# EAGLE design YOTSUBA_AP_EM_ver.1.0 (EAGLE 9.6.2)
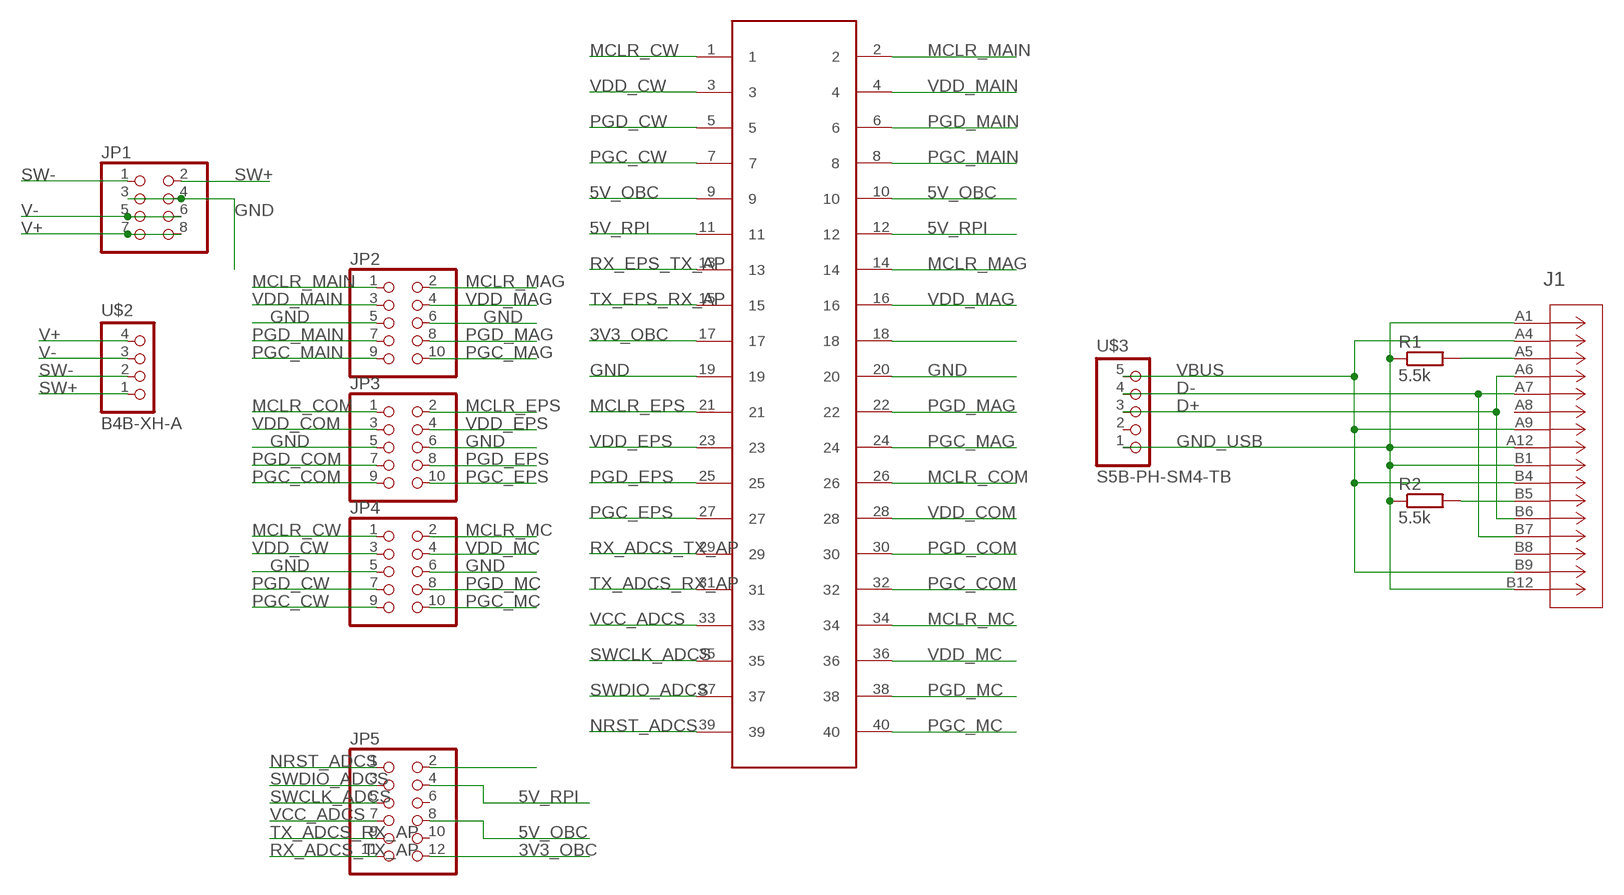
[diagram p0: schematic, sheet 1]

## Parts
J1  217182-0001  [CONN_217182-0001_MOL]
JP1  PINHD-2X4  [2X04]
JP2  PINHD-2X5  [2X05]
JP3  PINHD-2X5  [2X05]
JP4  PINHD-2X5  [2X05]
JP5  PINHD-2X6  [2X06]
R1  5.5k  R-EU_M2012  [M2012]
R2  5.5k  R-EU_M2012  [M2012]
U$1  M50-3902042  [M50-3902042]
U$2  B4B-XH-A  [B4B-XH-A]
U$3  S5B-PH-SM4-TB  [S5B-PH-SM4-TB]

## Nets
3V3_OBC: JP5.12 U$1.17
5V_OBC: JP5.8 U$1.9 U$1.10
5V_RPI: JP5.4 U$1.11 U$1.12
D+: J1.A6(DP1) J1.B6(DP2) U$3.3
D-: J1.A7(DN1) J1.B7(DN2) U$3.4
GND [gnd]: JP1.3 JP1.4 JP2.5 JP2.6 JP3.5 JP3.6 JP4.5 JP4.6 U$1.19 U$1.20
GND_USB [gnd_usb]: J1.A1(GND_2) J1.A12(GND_3) J1.B1(GND_4) J1.B12(GND) R1.1 R2.1 U$3.1
MCLR_COM: JP3.1 U$1.26
MCLR_CW: JP4.1 U$1.1
MCLR_EPS: JP3.2 U$1.21
MCLR_MAG: JP2.2 U$1.14
MCLR_MAIN: JP2.1 U$1.2
MCLR_MC: JP4.2 U$1.34
N$1: JP5.2
N$2: J1.A5(CC1) R1.2
N$3: J1.B5(CC2) R2.2
N$12: U$1.18
NRST_ADCS: JP5.1 U$1.39
PGC_COM: JP3.9 U$1.32
PGC_CW: JP4.9 U$1.7
PGC_EPS: JP3.10 U$1.27
PGC_MAG: JP2.10 U$1.24
PGC_MAIN: JP2.9 U$1.8
PGC_MC: JP4.10 U$1.40
PGD_COM: JP3.7 U$1.30
PGD_CW: JP4.7 U$1.5
PGD_EPS: JP3.8 U$1.25
PGD_MAG: JP2.8 U$1.22
PGD_MAIN: JP2.7 U$1.6
PGD_MC: JP4.8 U$1.38
RX_ADCS_TX_AP: JP5.11 U$1.29
RX_EPS_TX_AP: U$1.13
SW+ [pwr]: JP1.2 U$2.1
SW- [pwr]: JP1.1 U$2.2
SWCLK_ADCS: JP5.5 U$1.35
SWDIO_ADCS: JP5.3 U$1.37
TX_ADCS_RX_AP: JP5.9 U$1.31
TX_EPS_RX_AP: U$1.15
V+ [pwr]: JP1.7 JP1.8 U$2.4
V- [pwr]: JP1.5 JP1.6 U$2.3
VBUS: J1.A4(VBUS_2) J1.A9(VBUS_3) J1.B4(VBUS_4) J1.B9(VBUS) U$3.5
VCC_ADCS: JP5.7 U$1.33
VDD_COM: JP3.3 U$1.28
VDD_CW: JP4.3 U$1.3
VDD_EPS: JP3.4 U$1.23
VDD_MAG: JP2.4 U$1.16
VDD_MAIN: JP2.3 U$1.4
VDD_MC: JP4.4 U$1.36
Unconnected: J1.A8(SBU1) J1.B8(SBU2) JP5.6 JP5.10 U$3.2

## Library data of the parts
J1 = 2171820001:217182-0001; COPYRIGHT: Copyright (C) 2022 Ultra Librarian. All rights reserved.; DIGI-KEY_PART_NUMBER_1: 900-2171820001TR-ND; DIGI-KEY_PART_NUMBER_2: 900-2171820001CT-ND; DIGI-KEY_PART_NUMBER_3: 900-2171820001DKR-ND; MANUFACTURER_PART_NUMBER: 217182-0001; MFR_NAME: Molex Connector Corporation
JP1 = pinhead:PINHD-2X4: PIN HEADER
JP2-JP4 = pinhead:PINHD-2X5: PIN HEADER
JP5 = pinhead:PINHD-2X6: PIN HEADER
R1 R2 = rcl:R-EU_: RESISTOR, European symbol; SPICEPREFIX: R
U$1 = MITSUBA_Connectors-v4.0:M50-3902042: 40pins 1.27mm pitch 2line pinheader
U$2 = MITSUBA_Connectors-v4.0:B4B-XH-A
U$3 = MITSUBA_Connectors-v4.0:S5B-PH-SM4-TB

## Net classes
0 default: clearance 0.254 mm
1 gnd: clearance 0.559 mm
2 pwr: clearance 0.254 mm
3 gnd_usb: clearance 0.025 mm

## Board
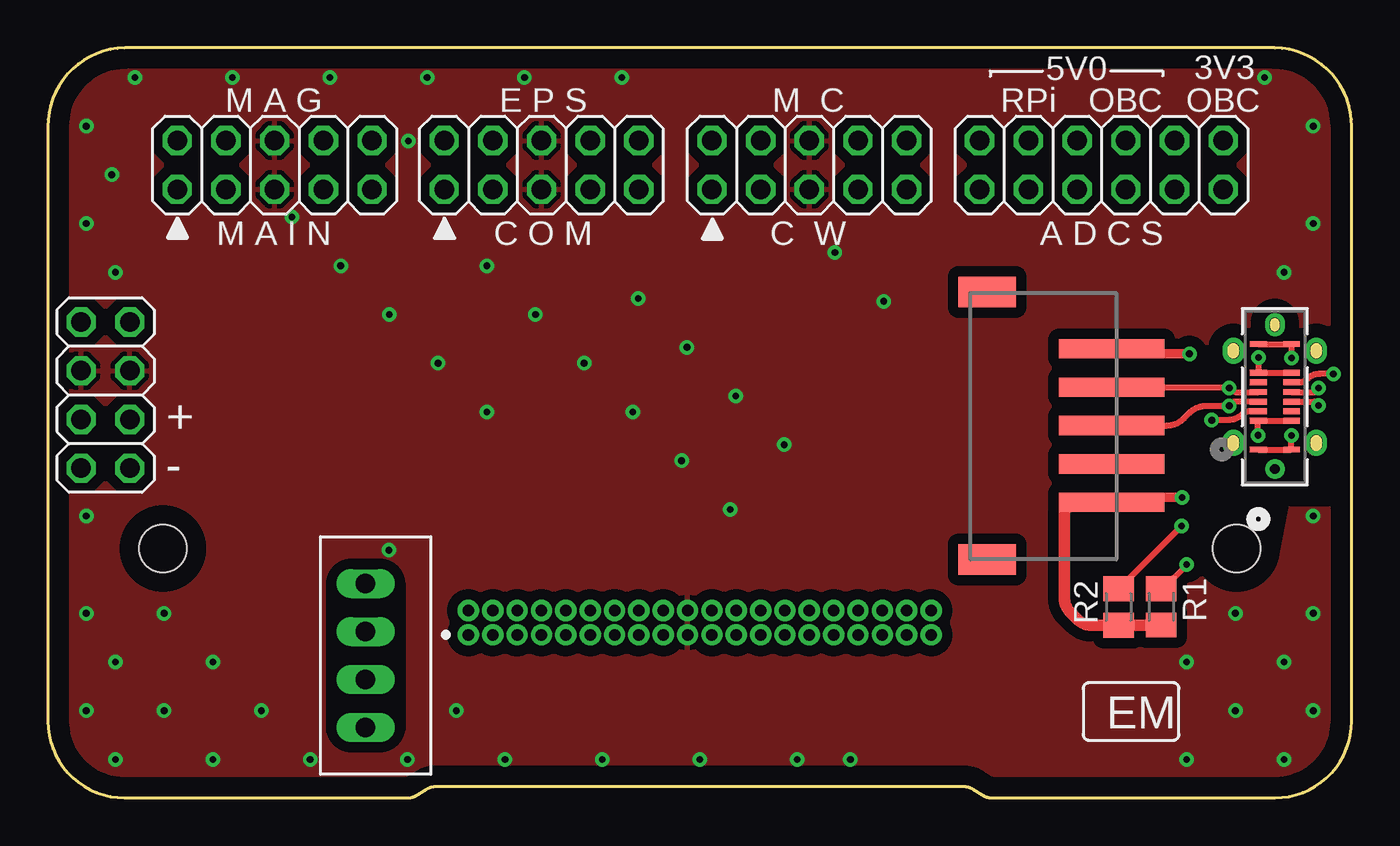
[diagram p1: board, top side]
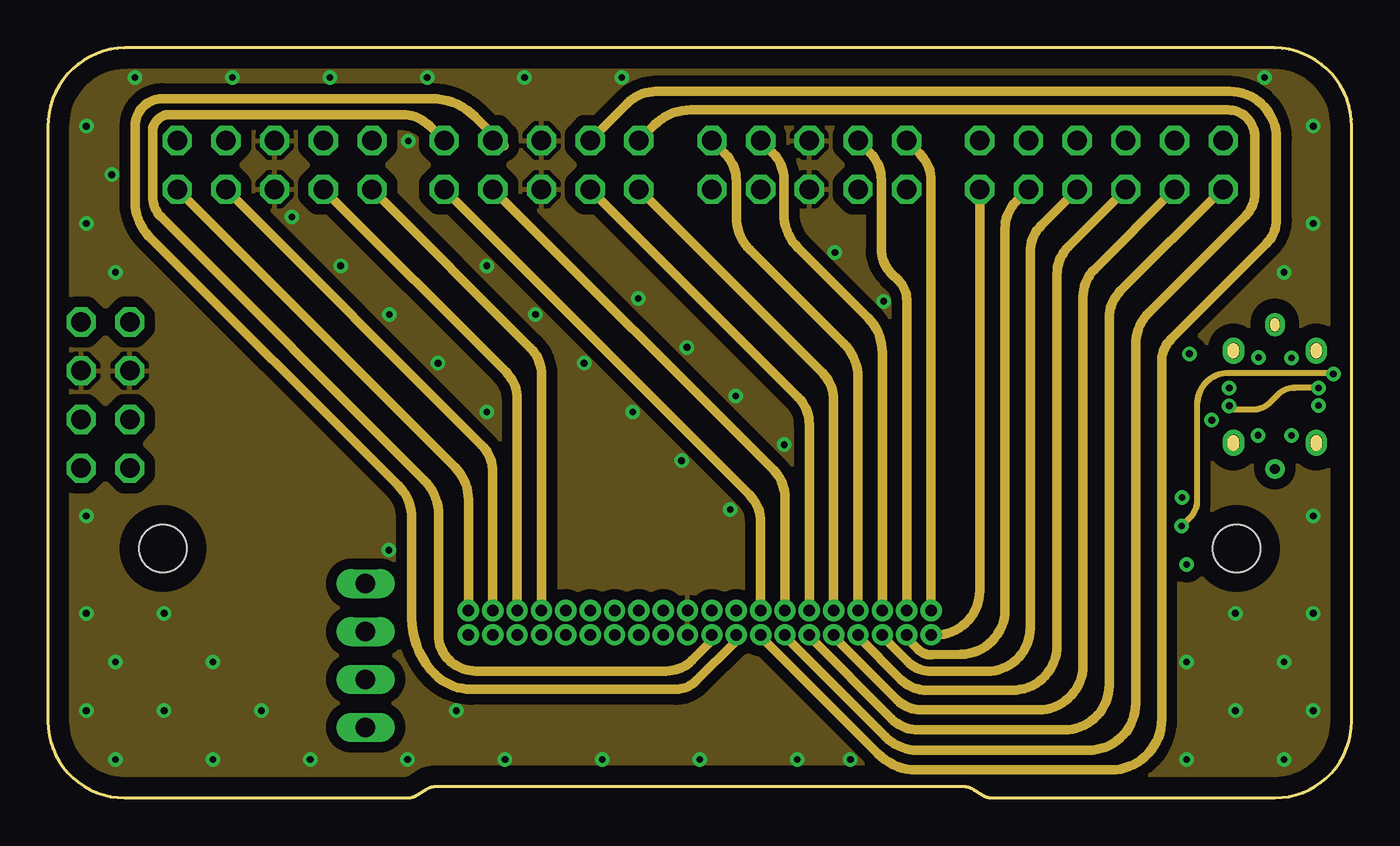
[diagram p2: board, inner layer Route2]
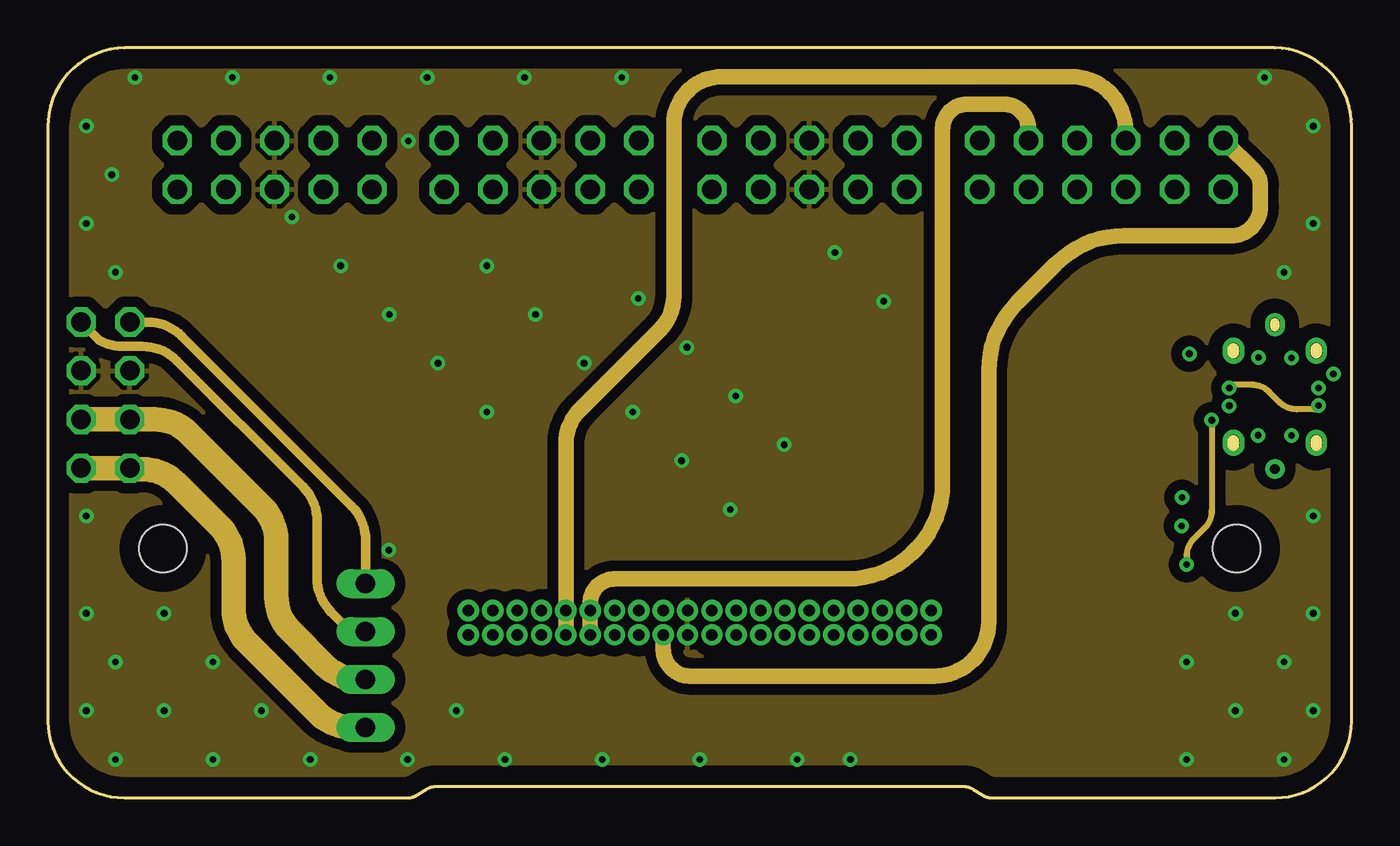
[diagram p3: board, inner layer Route15]
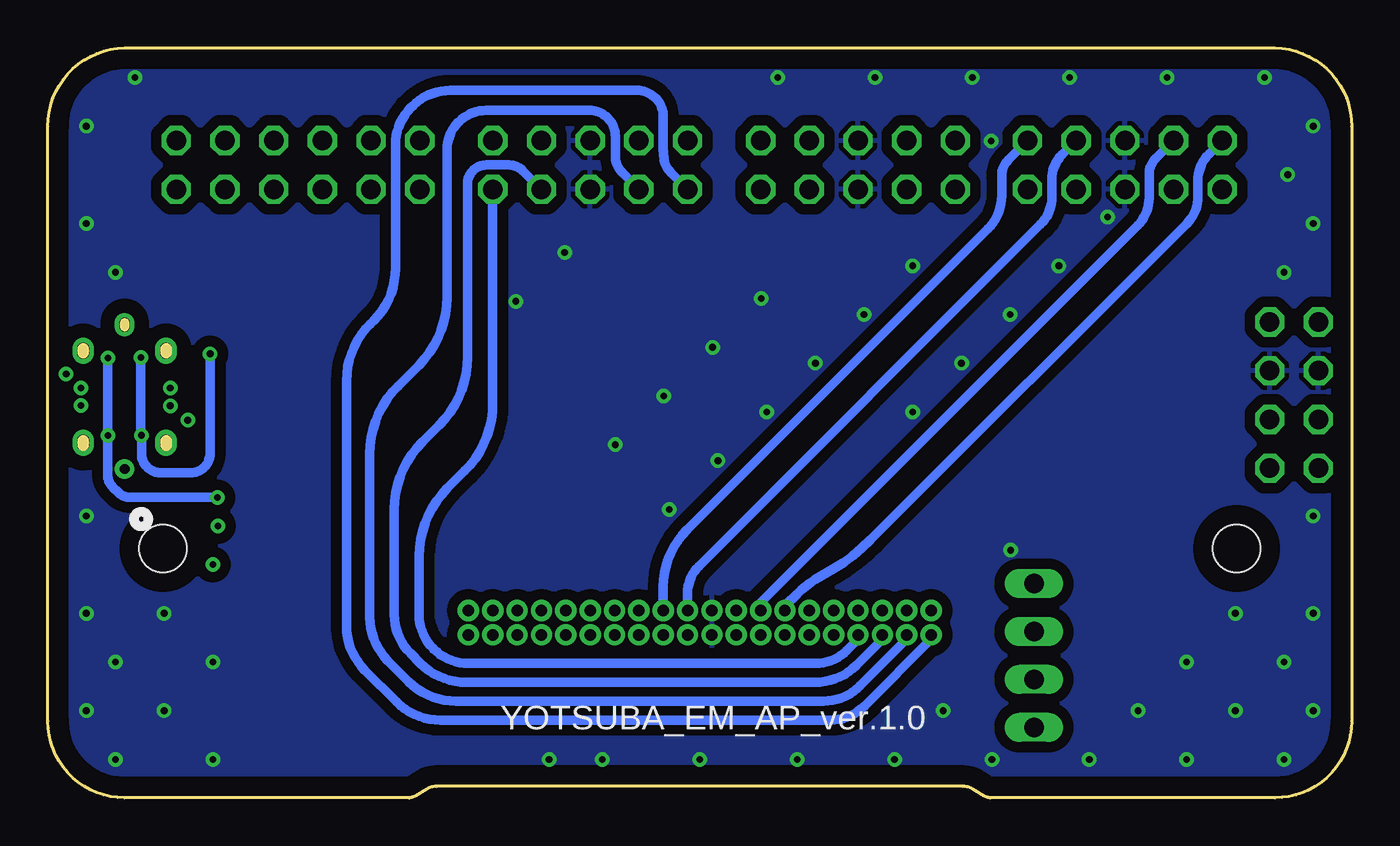
[diagram p4: board, bottom side, seen from below]

Size 68 x 39.1 mm. Coordinates in mm from the lower left corner, seen from the top.
Outline: 0,35 0,4 arc90 4,0 18.82,0 arc31 19.15,0.09 19.76,0.46 arc-31 20.28,0.6 47.72,0.6 arc-31 48.24,0.46 48.85,0.09 arc31 49.18,0 64,0 arc90 68,4 68,35 arc90 64,39.1 4,39.1 arc90 0,35
Copper layers (1+2*15+16): Top 0.035mm / dielectric 1.5mm / Route2 0.035mm / dielectric 0.15mm / Route15 0.035mm / dielectric 0.2mm / Bottom 0.035mm
Design rules "default *": minimum track width 6mil, minimum drill 0.35mm, track to track 6mil, track to pad 6mil, pad to pad 6mil, via to via 6mil, smd to smd 6mil, copper to edge 40mil, drill to drill 6mil, minimum pad ring 10mil, minimum via ring 8mil, stop-mask expansion 4mil, vias tented up to drill 0mil, thermal gap 10mil
Holes 2.5 mm at 6,13 62,13
tRestrict: 6 lines

### Footprints (pad centres in the part's own frame; a part is rotated, then mirrored left to right if it is on the bottom)
CONN_217182-0001_MOL = smd 1.346 x 1.092: 17 -2.4,2.15; 18 2.4,2.15; 19 -2.4,-2.15; 20 2.4,-2.15 | drill 0.508 pad 0.508: 21 -3.759,0; S_1_H1 3.861,0; S_1_H2 3.658,0 | smd 0.305 x 0.864: A1 -2.75,0.865; A4 -1.25,0.865; A5 -0.75,0.865; A6 -0.25,0.865; A7 0.25,0.865; A8 0.75,0.865; A9 1.25,0.865; A12 2.75,0.865; B1 2.75,-0.865; B4 1.25,-0.865; B5 0.75,-0.865; B6 0.25,-0.865; B7 -0.25,-0.865; B8 -0.75,-0.865; B9 -1.25,-0.865; B12 -2.75,-0.865 | drill 0.61 pad 0.61: S_2_H1 -2.286,2.159; S_2_H2 -2.515,2.159; S_3_H1 2.515,2.159; S_3_H2 2.286,2.159; S_4_H1 -2.286,-2.159; S_4_H2 -2.515,-2.159; S_5_H1 2.515,-2.159; S_5_H2 2.286,-2.159
2X04 = drill 1.016 octagon: 1 -3.81,-1.27; 2 -3.81,1.27; 3 -1.27,-1.27; 4 -1.27,1.27; 5 1.27,-1.27; 6 1.27,1.27; 7 3.81,-1.27; 8 3.81,1.27
2X05 = drill 1.016 octagon: 1 -5.08,-1.27; 2 -5.08,1.27; 3 -2.54,-1.27; 4 -2.54,1.27; 5 0,-1.27; 6 0,1.27; 7 2.54,-1.27; 8 2.54,1.27; 9 5.08,-1.27; 10 5.08,1.27
2X06 = drill 1.016 octagon: 1 -6.35,-1.27; 2 -6.35,1.27; 3 -3.81,-1.27; 4 -3.81,1.27; 5 -1.27,-1.27; 6 -1.27,1.27; 7 1.27,-1.27; 8 1.27,1.27; 9 3.81,-1.27; 10 3.81,1.27; 11 6.35,-1.27; 12 6.35,1.27
M2012 = smd 1.3 x 1.6: 1 -0.95,0; 2 0.95,0
M50-3902042 = drill 0.6: 1 0,0; 2 0,1.27; 3 1.27,0; 4 1.27,1.27; 5 2.54,0; 6 2.54,1.27; 7 3.81,0; 8 3.81,1.27; 9 5.08,0; 10 5.08,1.27; 11 6.35,0; 12 6.35,1.27; 13 7.62,0; 14 7.62,1.27; 15 8.89,0; 16 8.89,1.27; 17 10.16,0; 18 10.16,1.27; 19 11.43,0; 20 11.43,1.27; 21 12.7,0; 22 12.7,1.27; 23 13.97,0; 24 13.97,1.27; 25 15.24,0; 26 15.24,1.27; 27 16.51,0; 28 16.51,1.27; 29 17.78,0; 30 17.78,1.27; 31 19.05,0; 32 19.05,1.27; 33 20.32,0; 34 20.32,1.27; 35 21.59,0; 36 21.59,1.27; 37 22.86,0; 38 22.86,1.27; 39 24.13,0; 40 24.13,1.27
B4B-XH-A = drill 1.016 long: 1 0,0; 2 2.5,0; 3 5,0; 4 7.5,0
S5B-PH-SM4-TB = smd 1 x 5.5: 1 0,0; 2 2,0; 3 4,0; 4 6,0; 5 8,0 | smd 1.6 x 3: MP1 -2.983,6.5; MP2 10.959,6.5

### Placement (x,y rotation side)
J1  64,20.91 90 top
JP1  3,21 270 top
JP2  11.82,33 0 top
JP3  25.75,33 0 top
JP4  39.72,33 0 top
JP5  54.95,33 0 top
R1  58.07,9.96 90 top
R2  55.84,9.95 90 top
U$1  21.93,8.5 0 top
U$2  16.57,11.17 270 top
U$3  55.48,15.41 90 top

### Tracks (layer width: path | path; a pad name or v marks a point on that pad's centre or on a via)
3V3_OBC
  Route15 0.813: U$1.17 32.09,7.74 arc45 32.49,6.79 32.56,6.72 arc45 33.46,6.35 46.25,6.35 arc45 48.25,7.18 arc45 49.08,9.18 49.08,22.27 arc-45 50.54,25.8 52.59,27.85 arc-45 56.12,29.31 61.73,29.31 arc90 63.24,30.82 63.24,31.96 arc45 62.95,32.66 61.34,34.27 JP5.12
5V_OBC
  Route15 0.813: U$1.9 U$1.10 27.02,18.46 arc-45 27.75,20.23 31.92,24.4 arc45 32.65,26.17 32.65,35.1 arc-90 35.15,37.6 53.4,37.6 arc-90 56.22,34.78 56.23,34.78 JP5.8
5V_RPI
  Route15 0.813: U$1.11 U$1.12 28.29,10.14 arc-90 29.55,11.41 41.67,11.41 arc90 46.67,16.41 46.67,34.89 arc-90 47.94,36.16 49.88,36.16 arc-90 51.15,34.89 JP5.4
D+  (via drill 0.35)
  Top 0.254: v61.62,20.44 61.59,20.41
  Top 0.305: J1.B6 66.07,21.16 v66.28,21.37 | J1.A6 61.87,20.66 61.63,20.43 v61.62,20.44 60.44,20.44 arc45 59.54,20.07 59.25,19.78 arc-45 58.35,19.41 U$3.3
  Route2 0.254: v61.62,20.44 61.82,20.24
  Route2 0.305: v66.28,21.37 v66.27,21.38 65.05,21.38 arc45 64.15,21.01 63.75,20.61 arc-45 62.85,20.24 61.82,20.24
D-  (via drill 0.35)
  Top 0.305: J1.B7 66.06,20.66 v66.27,20.45 | J1.A7 61.93,21.16 61.72,21.37 v61.62,21.37 55.52,21.37 U$3.4
  Route15 0.254: v66.27,20.45 66.08,20.26 | v61.62,21.37 61.78,21.53
  Route15 0.305: 66.08,20.26 65.14,20.26 arc-45 64.24,20.63 63.71,21.16 arc45 62.81,21.53 61.78,21.53
GND  (via drill 0.35)
  other vias: 34,2 39.08,2 28.92,2 23.84,2 18.76,2 13.68,2 8.6,2 3.52,2 6.06,4.54 11.14,4.54 21.3,4.54 64.48,2 59.4,2 61.94,4.54 64.48,7.08 61.94,9.62 64.48,27.4 8.6,7.08 3.52,7.08 6.06,9.62 3.52,27.4 3.33,32.49 2,9.62 2,4.54 2,14.7 2,29.94 2,35.02 4.54,37.56 9.62,37.56 14.7,37.56 19.78,37.56 24.86,37.56 29.94,37.56 66,35.02 66,29.94 66,14.7 66,9.62 66,4.54 63.46,37.56 59.4,7.08 41.86,2 38.41,18.41 35.87,20.95 33.33,23.49 35.59,15.04 33.05,17.58 30.51,20.12 25.43,25.2 22.89,27.74 18.8,34.25 22.89,20.12 20.35,22.66 17.81,25.2 15.27,27.74 12.73,30.28 17.78,12.91 43.59,25.89 41.05,28.43 30.79,26.03 27.97,22.66
  pour Top: -2.42,40.81 70.36,40.81 70.36,1.49 70.36,-2.89 61.61,-2.89 -2.42,-2.89 -2.42,5.12
  pour Bottom: -1.61,42.21 71.83,42.21 71.83,-4.02 -1.61,-4.02
  pour Route2: -0.74,43.48 74.45,43.48 74.45,-5.15 -0.74,-5.15
  pour Route15: -3.47,44.69 73.18,44.69 73.18,-6.55 -3.47,-6.55
GND_USB  (via drill 0.35)
  Top 0.254: v64.86,18.89 v64.87,18.89 | J1.B1
  Top 0.305: J1.A12 J1.B1 | J1.A1 J1.B12 v64.86,18.89 | v64.87,22.93 J1.B1
  Top 0.508: 55.62,15.55 U$3.1 55.73,15.66 v59.16,15.66
  Top 0.61: R1.1 R2.1 54.42,9 arc-45 53.72,9.29 53.31,9.7 arc-45 53.02,10.4 53.02,14.98 53.45,15.41 U$3.1
  Bottom 0.508: v64.87,22.93 v64.87,18.89 64.89,18.87 64.89,16.88 arc-45 64.6,16.18 64.34,15.92 arc-45 63.71,15.66 v59.16,15.66
MCLR_COM
  Route2 0.508: JP3.1 36.59,15.81 arc-45 37.17,14.39 U$1.26
MCLR_CW
  Bottom 0.508: U$1.1 21.93,8.27 25.42,4.78 arc45 27.19,4.05 47.52,4.05 arc45 49.82,5 51.47,6.65 arc45 52.42,8.95 52.42,21.74 arc45 51.2,24.69 51.01,24.88 arc-45 49.88,27.62 49.88,34.04 arc45 49.07,35.98 48.97,36.09 arc45 47.02,36.89 37.28,36.89 arc90 35.91,35.52 35.91,33.74 35.88,33.72 35.88,33.5 arc-45 35.51,32.6 JP4.1
MCLR_EPS
  Route2 0.508: JP3.2 19.9,35.04 arc45 18.49,35.62 6.34,35.62 arc90 5.46,34.74 5.46,31.36 arc45 5.9,30.29 19.62,16.57 arc-45 20.38,14.74 20.38,8.48 arc45 20.91,7.19 arc45 22.31,6.61 32.25,6.61 arc45 33.59,7.16 34.63,8.21 U$1.21
MCLR_MAG
  Bottom 0.508: JP2.2 7.43,33.59 arc-45 8.02,32.17 8.02,31.35 arc45 8.6,29.94 25.09,13.45 arc14 27.04,11.93 27.96,11.38 arc-14 28.93,10.63 29.5,10.06 29.5,9.83 U$1.14
MCLR_MAIN
  Route2 0.508: JP2.1 21.23,17.24 arc-45 21.93,15.55 U$1.2
MCLR_MC
  Route2 0.508: JP4.2 35.32,33.58 arc-45 35.91,32.17 35.91,30.29 arc45 36.62,28.58 41.53,23.67 arc-45 42.26,21.92 U$1.34
N$2  (via drill 0.35)
  Top 0.305: J1.A5 62.7,20.16 arc45 62.29,19.99 arc-45 61.59,19.7 v60.72,19.7 v60.71,19.69 | 58.17,10.91 R1.2 58.14,10.91 v59.4,12.16 59.4,12.13
  Route15 0.305: v60.71,19.69 60.71,14.98 arc-45 60.34,14.08 59.77,13.51 arc45 59.4,12.61 v59.4,12.16
N$3  (via drill 0.35)
  Top 0.305: J1.B5 65.28,21.66 arc45 65.66,21.82 arc-45 66.36,22.11 v67.04,22.11 v67.05,22.1 | v59.13,14.19 v59.14,14.18 55.86,10.9 R2.2
  Route2 0.305: v67.05,22.1 67,22.15 61.57,22.15 arc90 59.94,20.52 59.94,15.51 arc-45 59.57,14.61 v59.14,14.18
NRST_ADCS
  Route2 0.508: JP5.1 48.6,10.79 arc-90 46.31,8.5 U$1.39
PGC_COM
  Route2 0.508: JP3.9 40.4,22.16 arc-45 40.98,20.74 U$1.32
PGC_CW
  Bottom 0.508: JP4.9 44.8,20.58 arc45 46.26,17.05 47.18,16.13 arc-45 48.64,12.59 48.64,9.56 arc-45 47.91,7.79 47.87,7.75 arc-45 46.08,7.01 27.95,7.01 arc-45 26.34,7.68 25.72,8.29 25.72,8.48 U$1.7
PGC_EPS
  Route2 0.508: JP3.10 31.64,35.09 arc-45 33.53,35.87 61.55,35.87 arc-90 62.95,34.47 62.95,31.5 arc-45 62.47,30.34 57.43,25.3 arc45 56.74,23.63 56.74,4.93 arc-90 54.29,2.48 45.37,2.48 arc-45 43.68,3.18 38.45,8.41 U$1.27
PGC_MAG
  Bottom 0.508: JP2.10 17.89,33.28 arc-45 18.25,32.42 18.25,31.4 arc45 18.97,29.67 34.67,13.97 arc-45 35.91,10.99 U$1.24
PGC_MAIN
  Route2 0.508: JP2.9 25.16,23.48 arc-45 25.75,22.06 U$1.8
PGC_MC
  Route2 0.508: JP4.10 45.48,33.59 arc-45 46.06,32.17 U$1.40
PGD_COM
  Route2 0.508: JP3.7 39.13,20.89 arc-45 39.72,19.47 U$1.30
PGD_CW
  Bottom 0.508: U$1.5 24.5,8.47 24.5,8.24 25.83,6.91 arc45 27.98,6.02 46.17,6.02 arc45 48.58,7.02 49.09,7.53 arc45 49.93,9.56 49.93,15.02 arc45 48.47,18.55 47.58,19.44 arc-45 46.12,22.97 46.12,32 arc90 45.12,33 43.94,33 arc45 43.23,32.71 JP4.7
PGD_EPS
  Route2 0.508: U$1.25 37.17,8.41 43.29,2.3 arc45 45.32,1.46 55.45,1.46 arc90 58.09,4.1 58.09,22.73 arc-45 58.59,23.93 63.55,28.89 arc45 64.08,30.16 64.08,34.4 arc90 61.65,36.83 31.7,36.83 arc45 30.24,36.22 JP3.8
PGD_MAG
  Bottom 0.508: U$1.22 34.63,10.65 arc45 34.05,12.07 16.22,29.9 arc-45 15.63,31.31 15.63,32.26 15.63,32.26 arc45 15.1,33.53 JP2.8
PGD_MAIN
  Route2 0.508: JP2.7 23.89,22.21 arc-45 24.48,20.79 U$1.6
PGD_MC
  Route2 0.508: JP4.8 42.88,33.64 arc-45 43.47,32.23 43.47,28.59 arc45 43.98,27.36 44.38,26.96 arc-45 44.8,25.96 U$1.38
RX_ADCS_TX_AP
  Route2 0.508: U$1.29 39.72,8.41 44.01,4.12 arc45 45.4,3.54 53.01,3.54 arc90 55.36,5.89 55.36,25.01 arc-45 55.95,26.43 61.25,31.73 JP5.11
SW+
  Route15 0.508: JP1.2 5.19,24.81 arc-45 6.98,24.07 15.84,15.21 arc-45 16.57,13.44 U$2.1
SW-
  Route15 0.508: JP1.1 2.69,23.85 arc29 3.89,23.54 4.93,23.54 arc-45 6.72,22.8 13.31,16.21 arc-45 14.04,14.44 14.04,11.46 arc45 14.78,9.67 15.78,8.67 U$2.2
SWCLK_ADCS
  Route2 0.508: U$1.35 43.52,8.41 44.83,7.11 arc45 46.08,6.59 48.98,6.59 arc90 51.23,8.85 51.23,28.45 arc-45 51.82,29.87 JP5.5
SWDIO_ADCS
  Route2 0.508: JP5.3 50.52,31.11 arc45 49.92,29.69 49.92,9.82 arc-89 47.61,7.48 46.09,7.46 arc-46 45.37,7.74 44.8,8.32 U$1.37
TX_ADCS_RX_AP
  Route2 0.508: JP5.9 54.58,27.55 arc45 53.99,26.13 53.99,6.9 arc-90 51.67,4.58 45.55,4.58 arc-45 44.3,5.09 40.98,8.41 U$1.31
V+
  Route15 1.27: U$2.4 15.88,3.67 arc-45 14.09,4.41 10.42,8.08 arc-45 9.68,9.88 9.68,12.39 arc45 8.93,14.19 6.74,16.39 arc45 4.94,17.13 4.33,17.13 JP1.8 JP1.7
V-
  Route15 1.27: JP1.5 JP1.6 5.58,19.73 arc-45 7.37,18.99 11.18,15.18 arc-45 11.91,13.41 11.91,10.5 arc45 12.65,8.71 14.45,6.91 arc45 16.24,6.17 U$2.3
VBUS  (via drill 0.35)
  Top 0.254: J1.A9 63.15,22.18 | 63.12,19.64 J1.A4
  Top 0.305: 55.48,23.29 U$3.5 | J1.A9 J1.B4 | J1.A4 J1.B9 | 63.15,22.18 v63.15,22.96 | v63.12,18.9 63.12,19.64
  Top 0.508: U$3.5 55.74,23.15 v59.54,23.15
  Bottom 0.254: 63.15,18.93 v63.12,18.9
  Bottom 0.508: v63.15,22.96 63.15,18.93 | v59.54,23.15 59.54,17.95 arc90 60.54,16.95 62.12,16.95 arc90 63.12,17.95 v63.12,18.9
VCC_ADCS
  Route2 0.508: JP5.7 53.22,28.73 arc45 52.63,27.31 52.63,7.94 arc-90 50.3,5.61 45.84,5.61 arc-45 44.5,6.17 42.26,8.41 U$1.33
VDD_COM
  Route2 0.508: JP3.3 37.86,17.08 arc-45 38.45,15.66 U$1.28
VDD_CW
  Bottom 0.508: U$1.3 23.13,8.43 23.13,8.34 25.64,5.83 arc45 27.56,5.04 46.72,5.04 arc45 49.18,6.06 50.27,7.15 arc45 51.21,9.42 51.21,17.93 arc45 49.75,21.46 48.64,22.57 arc-45 47.18,26.1 47.18,33.81 arc45 46.59,35.23 46.56,35.26 arc45 45.15,35.84 39.76,35.84 arc45 38.8,35.45 arc45 38.41,34.49 38.41,33.5 arc-45 38.03,32.6 JP4.3
VDD_EPS
  Route2 0.508: U$1.23 | U$1.23 35.91,8.2 33.8,6.09 arc-45 32.75,5.66 22.07,5.66 arc-45 20.19,6.44 arc-45 18.98,9.36 18.98,14.55 arc45 18.26,16.3 5.27,29.29 arc-45 4.55,31.03 4.55,35.04 arc-90 5.96,36.45 20.01,36.45 arc-45 22.28,35.51 23.79,34 23.48,34 JP3.4
VDD_MAG
  Bottom 0.508: JP2.4 10.22,33.34 arc-45 10.56,32.51 10.56,31.28 arc45 11.14,29.86 30.91,10.1 30.91,9.85 U$1.16
VDD_MAIN
  Route2 0.508: JP2.3 22.62,18.4 arc-45 23.2,16.98 U$1.4
VDD_MC
  Route2 0.508: JP4.4 37.8,33.64 arc-45 38.39,32.23 38.39,30.46 arc45 39.13,28.67 42.77,25.03 arc-45 43.52,23.21 U$1.36

### Text on the board
tNames: 5V0 | 3V3 | M A G | E P S | M C | RPi | OBC | OBC | M A I N | C O M | C W | A D C S | + | - | EM
bNames: YOTSUBA_EM_AP_ver.1.0